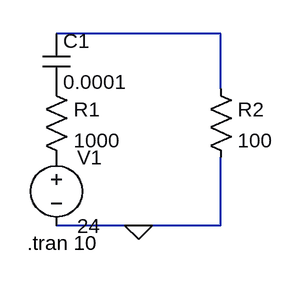
[diagram p0: schematic test1.asc]
test1.asc, the LTspice schematic file:
Version 4
SHEET 1 880 680
WIRE 272 -16 80 -16
WIRE 272 48 272 -16
WIRE 176 208 80 208
WIRE 272 208 272 128
WIRE 272 208 176 208
FLAG 176 208 0
SYMBOL voltage 80 112 R0
WINDOW 123 0 0 Left 0
WINDOW 39 0 0 Left 0
SYMATTR InstName V1
SYMATTR Value 24
SYMBOL res 64 32 R0
SYMATTR InstName R1
SYMATTR Value 1000
SYMBOL res 256 32 R0
SYMATTR InstName R2
SYMATTR Value 100
SYMBOL cap 64 -16 R0
SYMATTR InstName C1
SYMATTR Value 0.0001
TEXT 46 228 Left 2 !.tran 10

The netlist it stands for:
* test1.asc
V1 P001 0 24
R1 P002 P001 1000
R2 N001 0 100
C1 N001 P002 0.0001
.tran 10
.backanno
.end